# EAGLE schematic schematic (EAGLE 6.3)
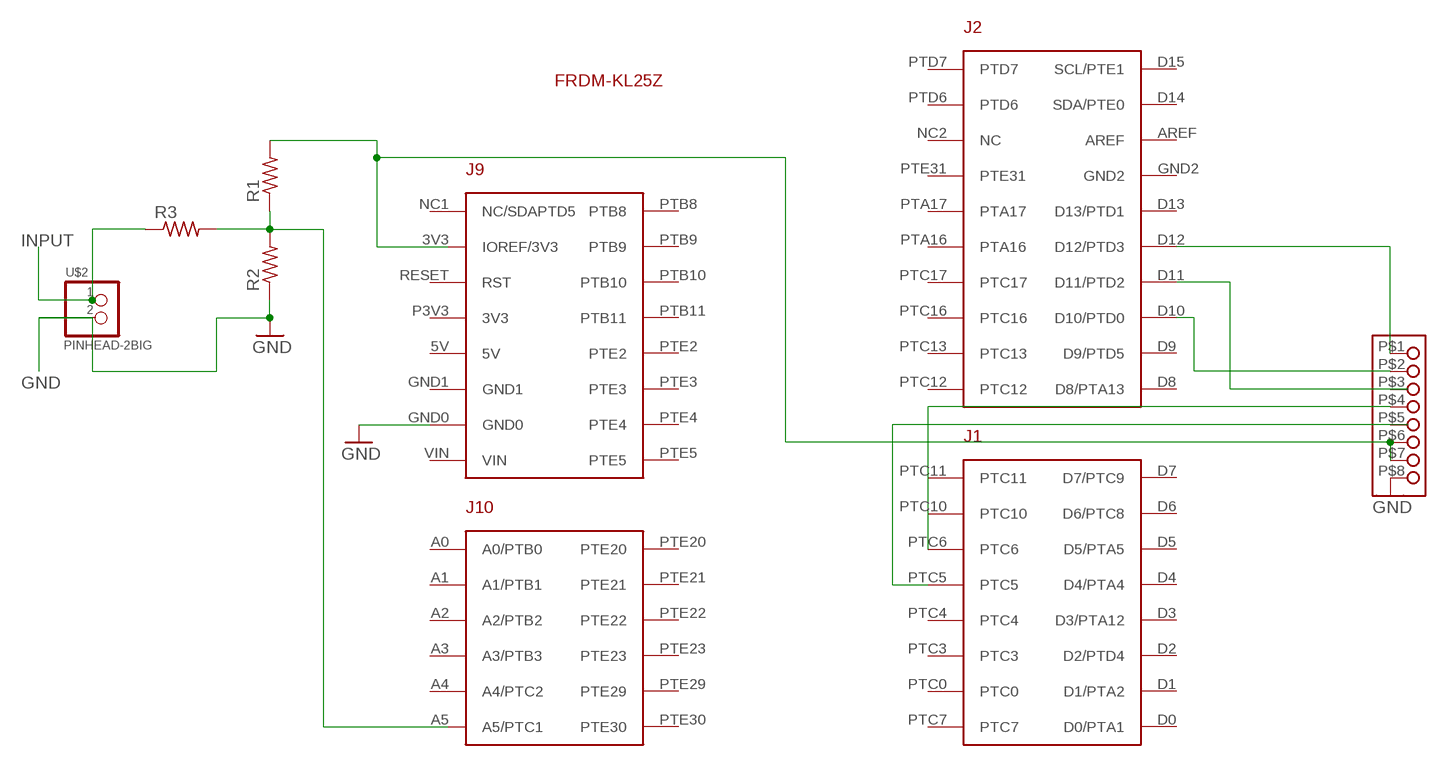
[diagram p0: schematic, sheet 1]

## Parts
FRDM1  FRDM-KL25ZARDUINO  [FRDM-KL25Z]
R1  R-US_0204/5  [0204/5]
R2  R-US_0204/5  [0204/5]
R3  R-US_0204/5  [0204/5]
U$1  PINHEAD-8  [PTH-8-1MM]
U$2  PINHEAD-2BIG  [BIGPIN-2]

## Nets
GND: FRDM1.GND0 R2.1 U$1.P$8 U$2.P$2
INPUT: R3.1 U$2.P$1
N$1: R1.2 U$1.P$6 U$1.P$7
N$2: FRDM1.D12(D12/PTD3) U$1.P$1
N$3: R1.1 R2.2 R3.2
N$4: FRDM1.D10(D10/PTD0) U$1.P$2
N$5: FRDM1.D11(D11/PTD2)
N$6: FRDM1.PTC6 U$1.P$4
N$7: FRDM1.PTC5
Unconnected: FRDM1.3V3(IOREF/3V3) FRDM1.5V FRDM1.A0(A0/PTB0) FRDM1.A1(A1/PTB1) FRDM1.A2(A2/PTB2) FRDM1.A3(A3/PTB3) FRDM1.A4(A4/PTC2) FRDM1.A5(A5/PTC1) FRDM1.AREF FRDM1.D0(D0/PTA1) FRDM1.D1(D1/PTA2) FRDM1.D2(D2/PTD4) FRDM1.D3(D3/PTA12) FRDM1.D4(D4/PTA4) FRDM1.D5(D5/PTA5) FRDM1.D6(D6/PTC8) FRDM1.D7(D7/PTC9) FRDM1.D8(D8/PTA13) FRDM1.D9(D9/PTD5) FRDM1.D13(D13/PTD1) FRDM1.D14(SDA/PTE0) FRDM1.D15(SCL/PTE1) FRDM1.GND1 FRDM1.GND2 FRDM1.NC1(NC/SDAPTD5) FRDM1.NC2(NC) FRDM1.P3V3(3V3) FRDM1.PTA16 FRDM1.PTA17 FRDM1.PTB8 FRDM1.PTB9 FRDM1.PTB10 FRDM1.PTB11 FRDM1.PTC0 FRDM1.PTC3 FRDM1.PTC4 FRDM1.PTC7 FRDM1.PTC10 FRDM1.PTC11 FRDM1.PTC12 FRDM1.PTC13 FRDM1.PTC16 FRDM1.PTC17 FRDM1.PTD6 FRDM1.PTD7 FRDM1.PTE2 FRDM1.PTE3 FRDM1.PTE4 FRDM1.PTE5 FRDM1.PTE20 FRDM1.PTE21 FRDM1.PTE22 FRDM1.PTE23 FRDM1.PTE29 FRDM1.PTE30 FRDM1.PTE31 FRDM1.RESET(RST) FRDM1.VIN U$1.P$3 U$1.P$5

## Library data of the parts
FRDM1 = Freedom:FRDM-KL25Z: For creating FRDM-KL25Z shields
R1-R3 = rcl:R-US_: RESISTOR, American symbol
U$1 = bt_electromech:PINHEAD-8: Pin Header Male
U$2 = bt_electromech:PINHEAD-2: Pin header (pinheader) x 2